# EAGLE design amplifier_board (EAGLE 9.0.0)
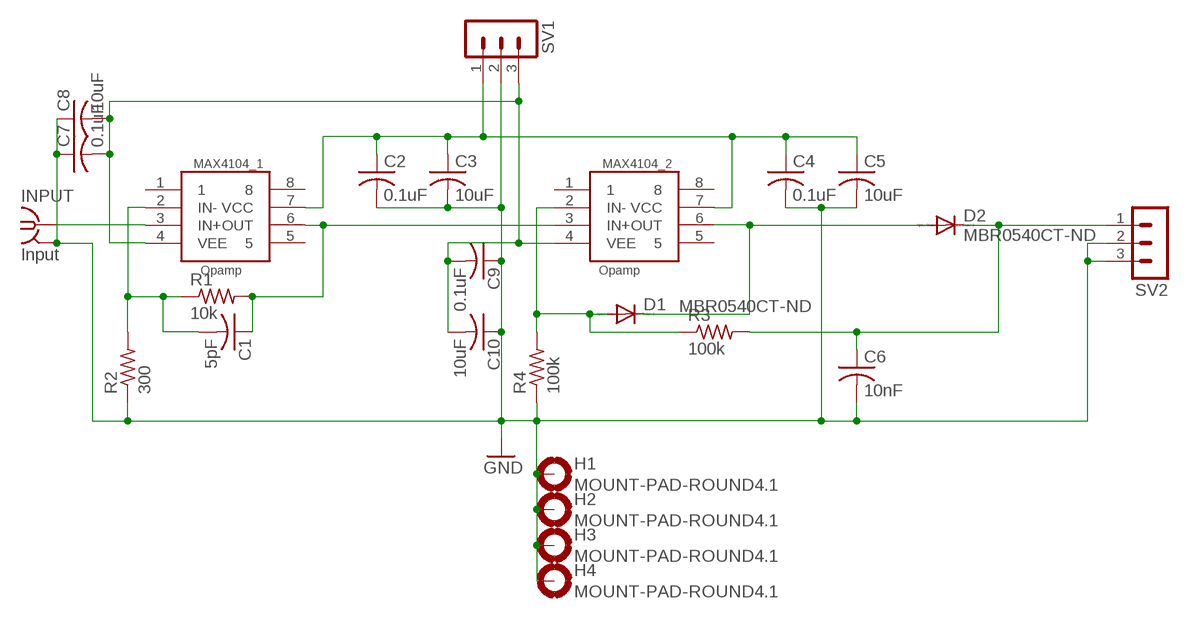
[diagram p0: schematic, sheet 1]

## Parts
C1  5pF  C-USC0603  [C0603]
C2  0.1uF  C-USC0603  [C0603]
C3  10uF  C-USC0603  [C0603]
C4  0.1uF  C-USC0603  [C0603]
C5  10uF  C-USC0603  [C0603]
C6  10nF  C-USC0603  [C0603]
C7  0.1uF  C-USC0603  [C0603]
C8  10uF  C-USC0603  [C0603]
C9  0.1uF  C-USC0603  [C0603]
C10  10uF  C-USC0603  [C0603]
D1  MBR0540CT-ND  CGRM4001-G  [SOD-123_MINI-SMA]
D2  MBR0540CT-ND  CGRM4001-G  [SOD-123_MINI-SMA]
H1  MOUNT-PAD-ROUND4.1  [4,1-PAD]
H2  MOUNT-PAD-ROUND4.1  [4,1-PAD]
H3  MOUNT-PAD-ROUND4.1  [4,1-PAD]
H4  MOUNT-PAD-ROUND4.1  [4,1-PAD]
INPUT  Input  SMA-EDGE  [SMA-EDGE]
MAX4104_1  Opamp  MAX4104  [SO8]
MAX4104_2  Opamp  MAX4104  [SO8]
R1  10k  R-US_R0603  [R0603]
R2  300  R-US_R0603  [R0603]
R3  100k  R-US_R0603  [R0603]
R4  100k  R-US_R0603  [R0603]
SV1  MA03-1  [MA03-1]
SV2  MA03-1  [MA03-1]

## Nets
AMP: C1.1 MAX4104_1.6(OUT) MAX4104_2.3(IN+) R1.2
DIG_READOUT: C6.1 D2.C R3.2 SV2.1
GND: C2.2 C3.2 C4.2 C5.2 C6.2 C7.1 C8.1 C9.1 C10.1 H1.B4,1(MOUNT) H2.B4,1(MOUNT) H3.B4,1(MOUNT) H4.B4,1(MOUNT) INPUT.G@1 INPUT.G@2 INPUT.G@3 INPUT.G@4 R2.1 R4.1 SV1.2 SV2.2 SV2.3
IN [high_freq]: INPUT.G@0 MAX4104_1.3(IN+)
IN-_1: C1.2 MAX4104_1.2(IN-) R1.1 R2.2
IN-_2: D1.A MAX4104_2.2(IN-) R3.1 R4.2
OUT_2: D1.C D2.A MAX4104_2.6(OUT)
VCC: C2.1 C3.1 C4.1 C5.1 MAX4104_1.7(VCC) MAX4104_2.7(VCC) SV1.1
VEE: C7.2 C8.2 C9.2 C10.2 MAX4104_1.4(VEE) MAX4104_2.4(VEE) SV1.3
Unconnected: MAX4104_1.1 MAX4104_1.5 MAX4104_1.8 MAX4104_2.1 MAX4104_2.5 MAX4104_2.8

## Library data of the parts
C1-C10 = rcl:C-US: CAPACITOR, American symbol; SPICEPREFIX: C
D1 D2 = diode:CGRM400*-G: Molded plasitc,JEDEC SOD-123/Mini SMA Source: Comchip CGRM4001-G.pdf; SPICEMODEL: DMBR0540; SPICEPREFIX: D
H1-H4 = holes:MOUNT-PAD-ROUND: MOUNTING PAD, round
INPUT = 000phys605parts:SMA-EDGE; SPICEPREFIX: V
MAX4104_1 MAX4104_2 = 000phys605parts:MAX4104; SPICEMODEL: MAX4104; SPICEPREFIX: X
R1-R4 = rcl:R-US_: RESISTOR, American symbol; SPICEPREFIX: R
SV1 SV2 = con-lstb:MA03-1: PIN HEADER; OC_FARNELL: unknown; OC_NEWARK: unknown

## Net classes
0 default: width 0.305 mm, clearance 0.305 mm
1 high_freq: width 3 mm, clearance 0.508 mm to class 0, clearance 0.508 mm

## Board
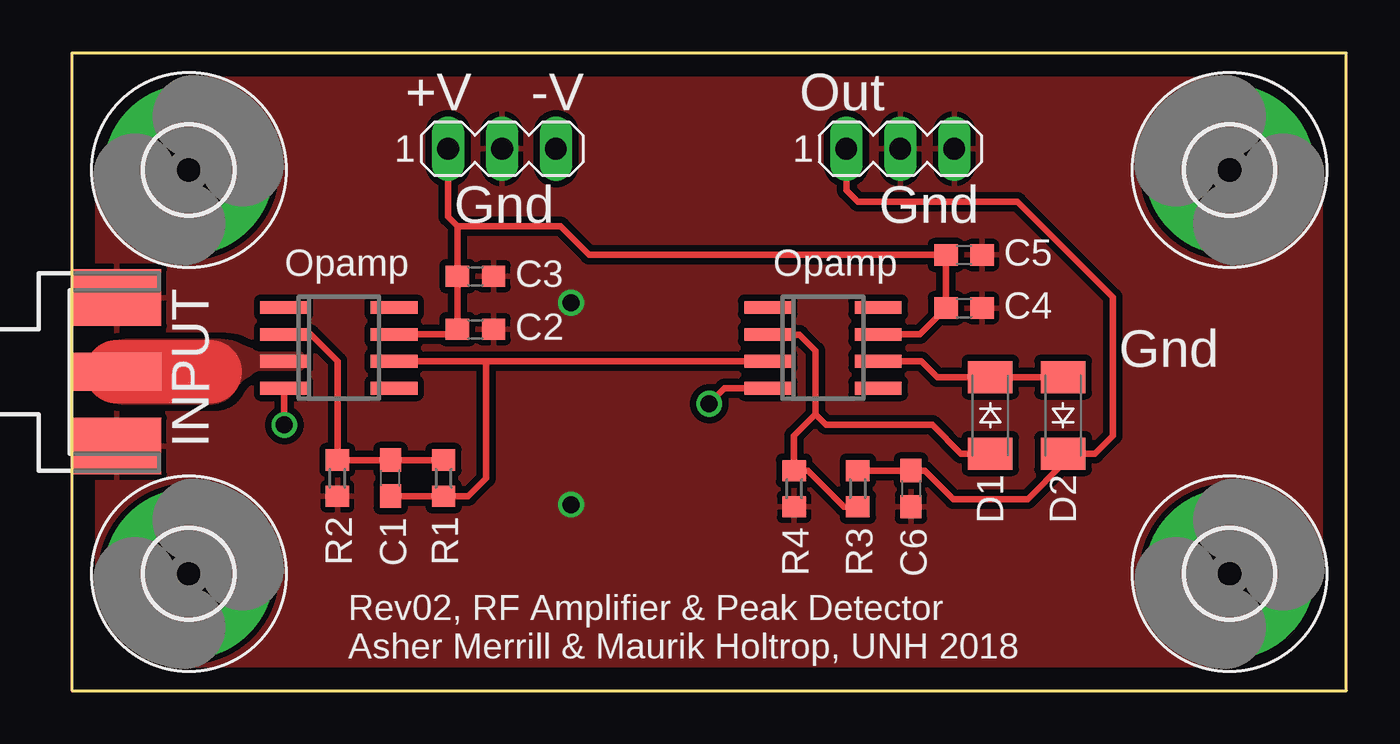
[diagram p1: board, top side]
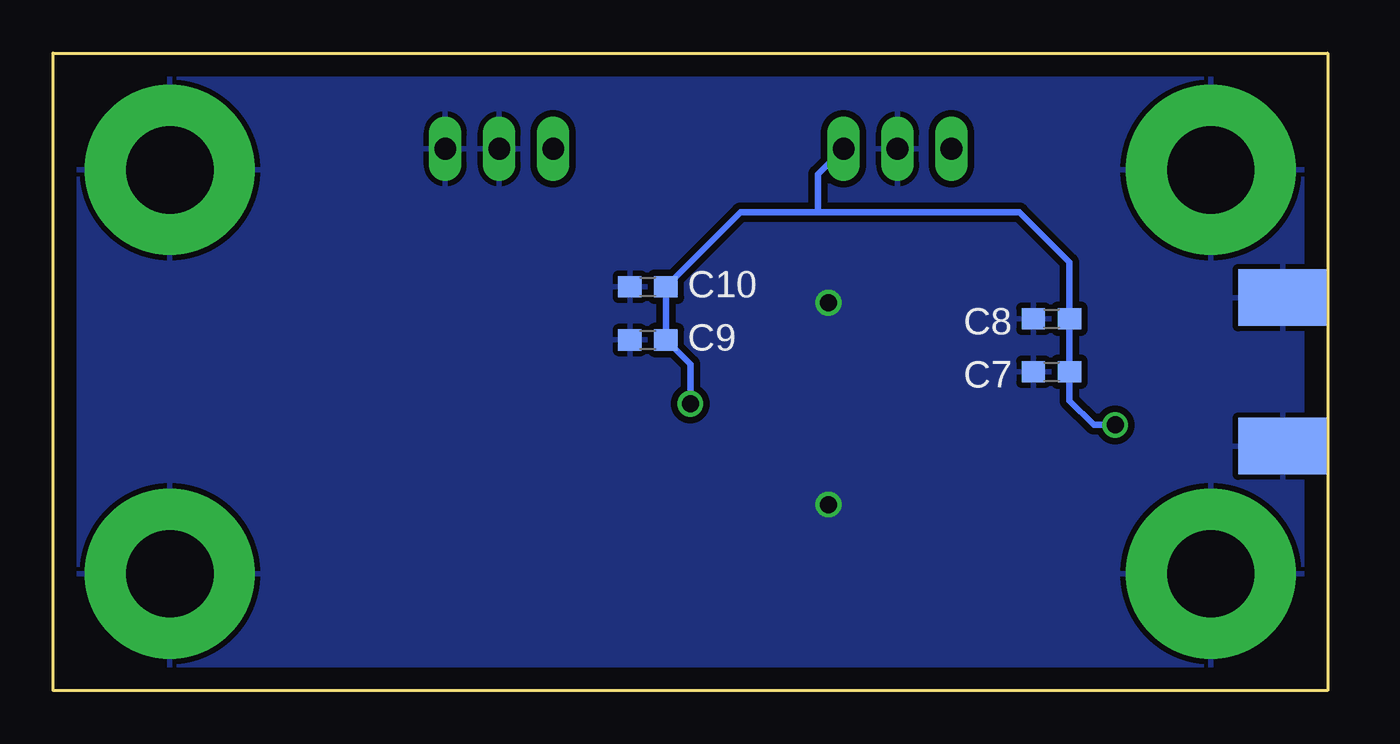
[diagram p2: board, bottom side, seen from below]

Size 60 x 30 mm. Coordinates in mm from the lower left corner, seen from the top.
Outline: 0,30 0,0 60,0 60,30 0,30
Copper layers (1*16): Top 0.035mm / dielectric 1.5mm / Bottom 0.035mm
Design rules "default": minimum track width 6mil, minimum drill 0.35mm, track to track 6mil, track to pad 6mil, pad to pad 6mil, via to via 6mil, smd to smd 6mil, copper to edge 40mil, drill to drill 6mil, minimum pad ring 10mil, minimum via ring 8mil, stop-mask expansion 4mil, vias tented up to drill 0mil, thermal gap 10mil

### Footprints (pad centres in the part's own frame; a part is rotated, then mirrored left to right if it is on the bottom)
C0603 = smd 1.1 x 1: 1 -0.85,0; 2 0.85,0
SOD-123_MINI-SMA = smd 1.5 x 2.1: A 1.8,0; C -1.8,0
4,1-PAD = drill 4.1 pad 8: B4,1 0,0
SMA-EDGE = smd 4.191 x 1.778: G@0 2.115,0 | smd 4.191 x 2.667: G@1 2.115,3.495; G@2 2.115,-3.495 | smd 4.191 x 2.667 bottom: G@3 2.115,3.495; G@4 2.115,-3.495
SO8 = smd 0.6 x 2.2: 1 -1.905,-2.6; 2 -0.635,-2.6; 3 0.635,-2.6; 4 1.905,-2.6; 5 1.905,2.6; 6 0.635,2.6; 7 -0.635,2.6; 8 -1.905,2.6
R0603 = smd 1 x 1.1: 1 -0.85,0; 2 0.85,0
MA03-1 = drill 1.016 long: 1 -2.54,0; 2 0,0; 3 2.54,0

### Placement (x,y rotation side)
C1  15,10 90 top
C2  19,17 0 top
C3  19,19.5 0 top
C4  42,18 0 top
C5  42,20.5 0 top
C6  39.5,9.5 270 top
C7  13,15 0 bottom
C8  13,17.5 0 bottom
C9  32,16.5 0 bottom
C10  32,19 0 bottom
D1  43.23,12.95 270 top
D2  46.66,12.95 90 top
H1  5.5,5.5 0 top
H2  5.5,24.5 0 top
H3  54.5,5.5 0 top
H4  54.5,24.5 90 top
INPUT  0,15 0 top
MAX4104_1  12.57,16.13 270 top
MAX4104_2  35.36,16.13 270 top
R1  17.5,10 270 top
R2  12.5,10 90 top
R3  37,9.5 90 top
R4  34,9.5 90 top
SV1  20.25,25.5 0 top
SV2  39,25.5 0 top

### Tracks (layer width: path | path; a pad name or v marks a point on that pad's centre or on a via)
AMP
  Top 0.305: MAX4104_1.6 19.5,15.5 | 19.5,15.5 19.5,10 18.65,9.15 R1.2 C1.1 | 19.5,15.5 MAX4104_2.3
DIG_READOUT
  Top 0.305: R3.2 C6.1 40.15,10.35 41.5,9 45,9 46.66,10.66 D2.C 48.15,11.15 49,12 49,18.5 44.5,23 37,23 36.46,23.54 SV2.1
GND  (via drill 0.8)
  other vias: 23.5,18.25 23.5,8.75
  pour Top (rank 6): 0,30 0,0 60,0 60,30
  pour Bottom: 0,30 0,0 60,0 60,30
IN
  Top 3: INPUT.G@0 6.5,15
  pour Top (isolate 0.508, no thermals): 3,16.5 2.5,16.5 arc180 2.5,13.5 6.5,13.5 arc62 7.75,14.25 arc-62 9,15 10.5,15 arc180 10.5,16 9,16 arc-28 8,16.25 arc28 7,16.5
IN-_1
  Top 0.305: 9.99,16.75 MAX4104_1.2 11.24,16.76 12.5,15.5 R2.2 C1.2 R1.1
IN-_2
  Top 0.305: 35,13 35,16 34.25,16.75 32.77,16.75 MAX4104_2.2 | 42.35,11.15 D1.A 41.85,11.15 40.5,12.5 35.5,12.5 35,13 | 35,13 34,12 R4.2 34.65,10.35 36.35,8.65 R3.1
OUT_2
  Top 0.305: D2.A D1.C 40.75,14.75 40,15.5 MAX4104_2.6
VCC
  Top 0.305: MAX4104_1.7 17.91,16.76 C2.1 C3.1 18.15,21.85 | MAX4104_2.7 39.91,16.76 C4.1 C5.1 24.35,20.5 23,21.85 18.15,21.85 | 18.15,21.85 17.71,22.29 SV1.1
VEE  (via drill 0.8)
  Top 0.305: MAX4104_1.4 10,14.2 v10,12.5 | v30,13.5 30.72,14.22 MAX4104_2.4
  Bottom 0.305: v10,12.5 11,12.5 12.15,13.65 C7.2 C8.2 12.15,20.15 14.5,22.5 24,22.5 | v30,13.5 30,15.35 C9.2 C10.2 27.65,22.5 24,22.5 | SV1.3 24,24.29 24,22.5

### Text on the board
tPlace: +V | -V | Out | Gnd | Gnd | Gnd | Rev02, RF Amplifier & Peak Detector / Asher Merrill & Maurik Holtrop, UNH 2018